# Altium schematic sheet TEBARRO.SchDoc
size A4
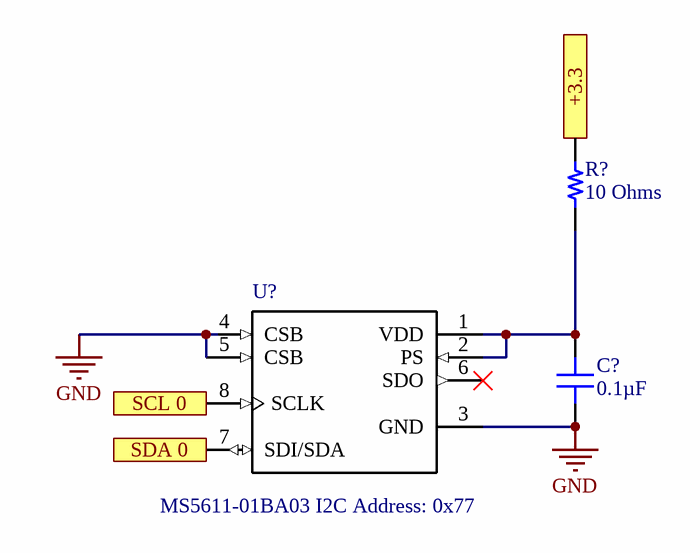
[diagram p0: TEBARRO.SchDoc]

## Parts
C?  0.1µF  [CAP 0603_1608]
R?  10 Ohms  [RES 0603_1608]
U?  MS561101BA03-50  [*SON125P500X300X100-8N]  (value not drawn)

## Ports
+3.3, SCL 0, SDA 0

## Nets
GND: C?.1 U?.3(GND) U?.4(CSB) U?.5(CSB)
+3.3: R?.2 ; port +3.3
SCL 0: U?.8(SCLK) ; port SCL 0
SDA 0: U?.7(SDI/SDA) ; port SDA 0
NetC?_2: C?.2 R?.1 U?.1(VDD) U?.2(PS)

Not connected (* = marked no-connect by the designer): U? 6(SDO)*

## Notes on the sheet
- (near U?) MS5611-01BA03 I2C Address: 0x77
- Title
- Size:
- Date:
- A4
- Author
- Time:
- Sheet
- Revision:
- of
- RIT Space Exploration Team
- Rochester Institute of Technology
- 1 Lomb Memorial Drive
- Rochester, NY 14623
- https://spex.rit.edu
- File:

## Library data of the parts
C? = 100X14W104MV4T: CAP CER 0.1UF 10V X7R 0603; Manufacturer: Johanson Dielectrics Inc.; Tolerance: ±20%; Part Number: 100X14W104MV4T; Value: 0.1µF; Applications: Bypass, Decoupling; Capacitance: 0.1µF; ComponentLink1Description: Datasheet; ComponentLink1URL: https://www.johansondielectrics.com/downloads/x2y-filter-and-decoupling-capacitors.pdf; ComponentLink2Description: DigiKey Link; ComponentLink2URL: http://digikey.com/product-detail/en/johanson-dielectrics-inc/100X14W104MV4T/709-1101-1-ND/1655915; Device Package: 0603 (1608 Metric); Features: Low ESL (X2Y); LastUpdated: 1/21/2020 12:02:09 AM; Lifecycle Status: Active; Minimum Order: 1; Mounting Type: Surface Mount, MLCC; Operating Temperature: -55°C ~ 125°C; Package / Case: 0603 (1608 Metric); Packaging: TapeAndReel; PartId: 2680; Part Status: Active; Price: 0.11; Series: X2Y®; Size / Dimension: 0.064" L x 0.035" W (1.63mm x 0.89mm); Supplier 1: DigiKey; Supplier Part Number 1: 709-1101-1-ND; Temperature Coefficient: X7R; Thickness (Max): 0.026" (0.66mm); Voltage - Rated: 10V
R? = SG731JTTD100K: SMD RESISTOR; Manufacturer: KOA Speer Electronics, Inc.; Power (Watts): 0.1W, 1/10W; Temperature Coefficient: ±200ppm/°C; Tolerance: ±10%; Part Number: SG731JTTD100K; Value: 10 Ohms; ComponentLink1Description: Datasheet; ComponentLink1URL: http://www.koaspeer.com/catimages/Products/SG73/SG73.pdf; ComponentLink2Description: DigiKey Link; ComponentLink2URL: http://digikey.com/product-detail/en/koa-speer-electronics-inc/SG731JTTD100K/2019-SG731JTTD100KCT-ND/10187255; Composition: Thick Film; Device Package: 0603 (1608 Metric); Features: Automotive AEC-Q200, Moisture Resistant, Pulse Withstanding; Height - Seated (Max): 0.022" (0.55mm); LastUpdated: 1/21/2020 12:19:43 AM; Lifecycle Status: Active; Minimum Order: 1; Number of Terminations: 2; Operating Temperature: -55°C ~ 155°C; Package / Case: 0603 (1608 Metric); Packaging: TapeAndReel; PartId: 17783; Part Status: Active; Price: 0.02; Ratings: AEC-Q200; Resistance: 10 Ohms; Series: SG73; Size / Dimension: 0.063" L x 0.031" W (1.60mm x 0.80mm); Supplier 1: DigiKey; Supplier Part Number 1: 2019-SG731JTTD100KCT-ND; Supplier Device Package: 0603
U? = MS561101BA03-50: Pressure Sensor 1.44V to 3.6V 0.01bar to 1.2bar Absolute 8-Pin QFN T/R; MF: TE Connectivity; SnapEDA_Link: https://www.snapeda.com/parts/MS561101BA03-50/TE%20Connectivity%20ALCOSWITCH%20Switches/view-part/213247/?ref=snap; Digi-Key_Part_Number: 223-1622-1-ND; EU_RoHS_Compliance: Compliant; TE_purchase_URL: https://www.te.com/usa-en/product-MS561101BA03-50.html?te_bu=Cor&te_type=disp&te_campaign=seda_glo_cor-seda-global-disp-prtnr-fy19-seda-model-bom-cta_sma-317_1&elqCampaignId=32493; Package: SMD-8 TE Connectivity; MP: MS561101BA03-50; Digi-Key_Purchase_URL: https://www.digikey.com/product-detail/en/te-connectivity-measurement-specialties/MS561101BA03-50/223-1622-1-ND/5277638?utm_source=snapeda&utm_medium=aggregator&utm_campaign=symbol; Value: *